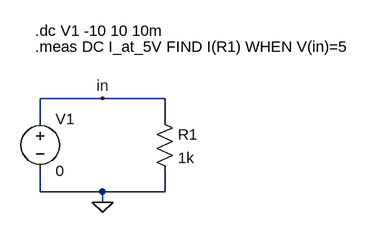
[diagram p0: schematic ideal_resistor_iv.asc]
ideal_resistor_iv.asc, the LTspice schematic file:
Version 4.1
SHEET 1 880 680
WIRE 176 96 80 96
WIRE 272 96 176 96
WIRE 80 128 80 96
WIRE 272 128 272 96
WIRE 80 240 80 208
WIRE 176 240 80 240
WIRE 272 240 272 208
WIRE 272 240 176 240
WIRE 176 256 176 240
FLAG 176 256 0
FLAG 176 96 in
SYMBOL voltage 80 112 R0
WINDOW 123 0 0 Left 0
WINDOW 39 0 0 Left 0
SYMATTR InstName V1
SYMATTR Value 0
SYMBOL res 256 112 R0
SYMATTR InstName R1
SYMATTR Value 1k
TEXT 72 -8 Left 2 !.dc V1 -10 10 10m
TEXT 72 16 Left 2 !.meas DC I_at_5V FIND I(R1) WHEN V(in)=5

The netlist it stands for:
* ideal_resistor_iv.asc
V1 in 0 0
R1 in 0 1k
.dc V1 -10 10 10m
.meas DC I_at_5V FIND I(R1) WHEN V(in)=5
.backanno
.end